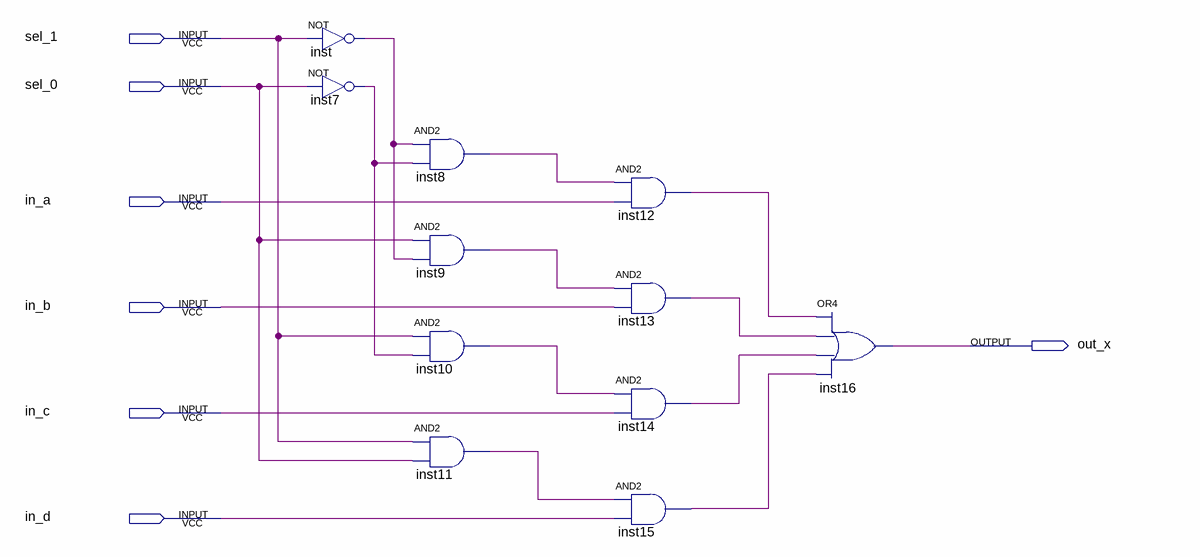
[diagram p0: schematic sheet]
// Quartus schematic mux.bdf as structural Verilog: 11 symbols, 7 pins
module mux (
  input  sel_1,
  input  sel_0,
  input  in_a,
  input  in_b,
  input  in_c,
  input  in_d,
  output out_x
);

  wire inst7_out, inst8_out, inst9_out, inst10_out, inst11_out, inst12_out, inst13_out, inst14_out,
       inst15_out, inst_out;

  not inst (inst_out, sel_1);
  not inst7 (inst7_out, sel_0);
  and inst8 (inst8_out, inst_out, inst7_out);
  and inst9 (inst9_out, sel_0, inst_out);
  and inst10 (inst10_out, sel_1, inst7_out);
  and inst11 (inst11_out, sel_1, sel_0);
  and inst12 (inst12_out, inst8_out, in_a);
  and inst13 (inst13_out, inst9_out, in_b);
  and inst14 (inst14_out, inst10_out, in_c);
  and inst15 (inst15_out, inst11_out, in_d);
  or inst16 (out_x, inst12_out, inst13_out, inst14_out, inst15_out);
endmodule
